# EAGLE design MirrorsDualAttenuverter (EAGLE 9.6.2)
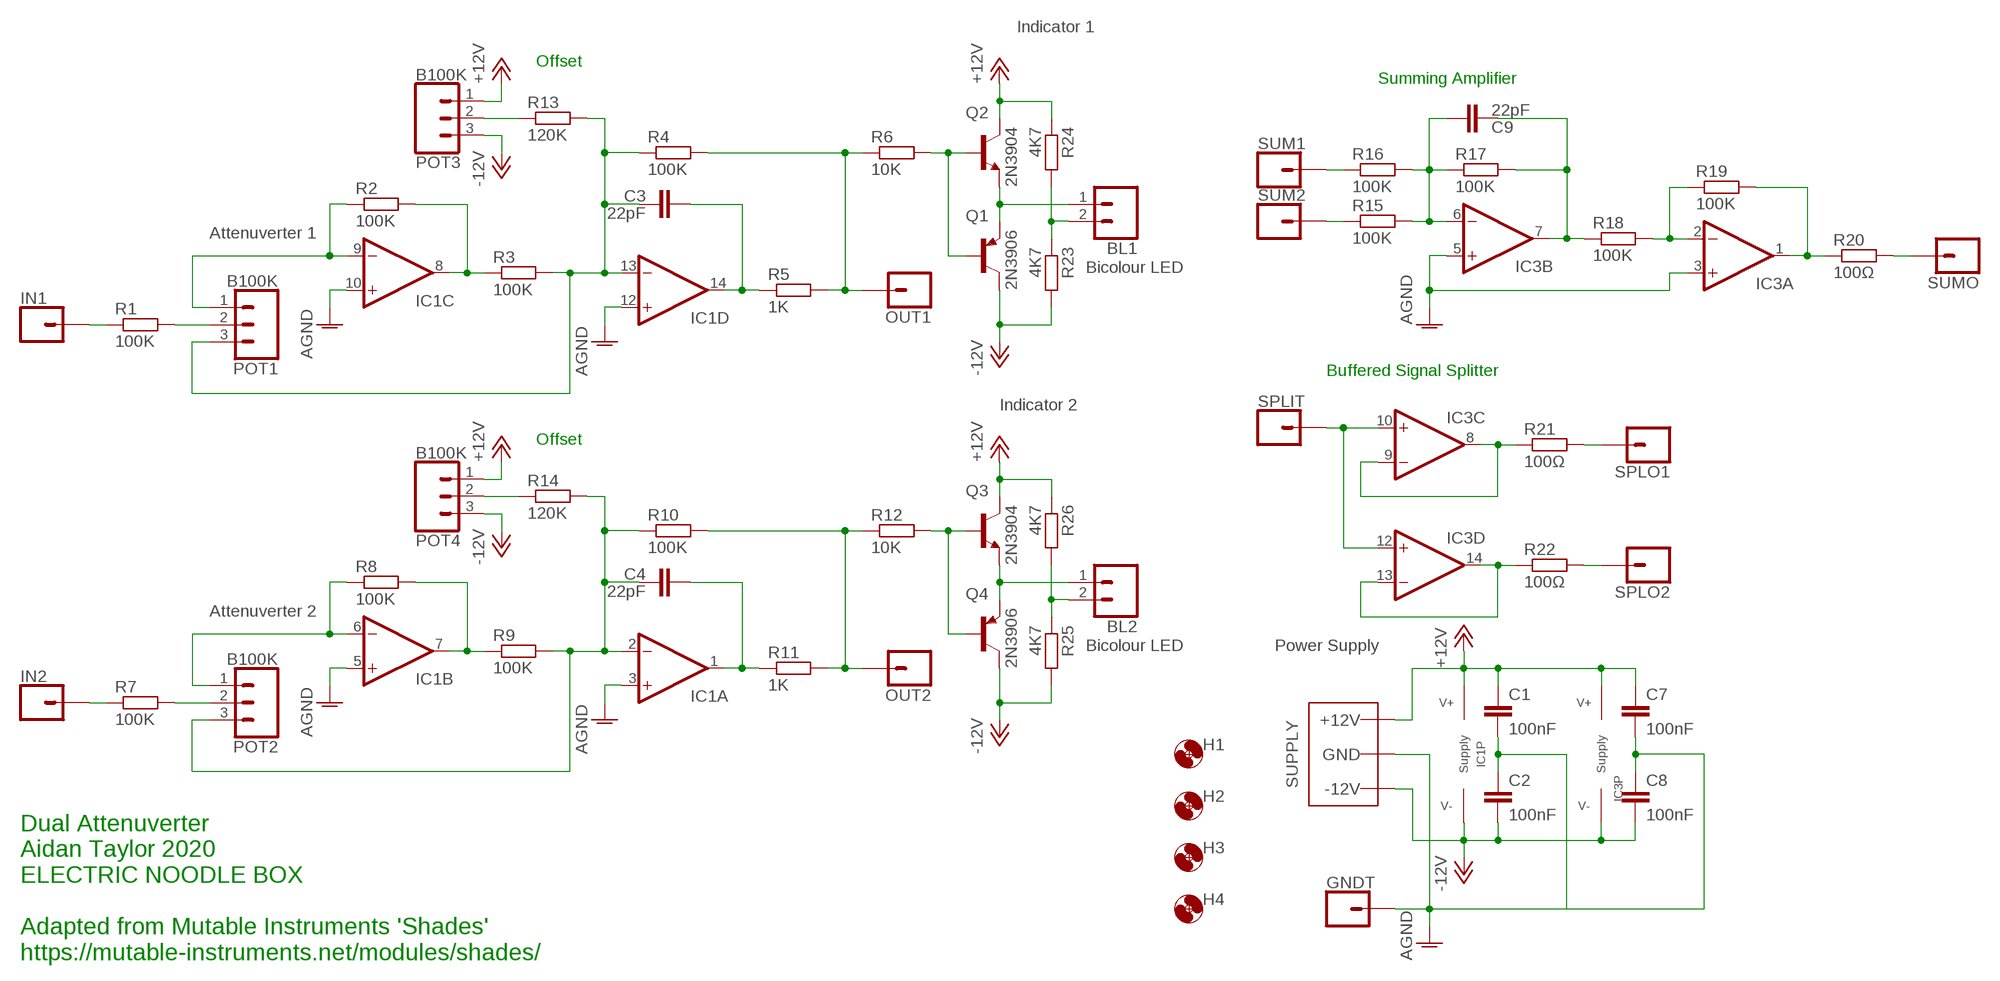
[diagram p0: schematic, sheet 1]

## Parts
BL1  2XWIREPAD  [1X02]
BL2  2XWIREPAD  [1X02]
C1  100nF  C-EU050-025X075  [C050-025X075]
C2  100nF  C-EU050-025X075  [C050-025X075]
C3  22pF  C-EU050-025X075  [C050-025X075]
C4  22pF  C-EU050-025X075  [C050-025X075]
C7  100nF  C-EU050-025X075  [C050-025X075]
C8  100nF  C-EU050-025X075  [C050-025X075]
C9  22pF  C-EU050-025X075  [C050-025X075]
GNDT  1XWIREPAD  [1X01]
H1  MOUNT-HOLE3.2  [3,2]
H2  MOUNT-HOLE3.2  [3,2]
H3  MOUNT-HOLE3.2  [3,2]
H4  MOUNT-HOLE3.2  [3,2]
IC1  TL0X4DIL  [DIL14]
IC3  TL0X4DIL  [DIL14]
IN1  1XWIREPAD  [1X01]
IN2  1XWIREPAD  [1X01]
OUT1  1XWIREPAD  [1X01]
OUT2  1XWIREPAD  [1X01]
POT1  B100K  3XWIREPAD  [1X03]
POT2  B100K  3XWIREPAD  [1X03]
POT3  B100K  3XWIREPAD  [1X03]
POT4  B100K  3XWIREPAD  [1X03]
Q1  2N3906  [TO92]
Q2  2N3904  [TO92]
Q3  2N3904  [TO92]
Q4  2N3906  [TO92]
R1  100K  R-EU_0207/10  [0207/10]
R2  100K  R-EU_0207/10  [0207/10]
R3  100K  R-EU_0207/10  [0207/10]
R4  100K  R-EU_0207/10  [0207/10]
R5  1K  R-EU_0207/10  [0207/10]
R6  10K  R-EU_0207/10  [0207/10]
R7  100K  R-EU_0207/10  [0207/10]
R8  100K  R-EU_0207/10  [0207/10]
R9  100K  R-EU_0207/10  [0207/10]
R10  100K  R-EU_0207/10  [0207/10]
R11  1K  R-EU_0207/10  [0207/10]
R12  10K  R-EU_0207/10  [0207/10]
R13  120K  R-EU_0207/10  [0207/10]
R14  120K  R-EU_0207/10  [0207/10]
R15  100K  R-EU_0207/10  [0207/10]
R16  100K  R-EU_0207/10  [0207/10]
R17  100K  R-EU_0207/10  [0207/10]
R18  100K  R-EU_0207/10  [0207/10]
R19  100K  R-EU_0207/10  [0207/10]
R20  100Ω  R-EU_0207/10  [0207/10]
R21  100Ω  R-EU_0207/10  [0207/10]
R22  100Ω  R-EU_0207/10  [0207/10]
R23  4K7  R-EU_0207/10  [0207/10]
R24  4K7  R-EU_0207/10  [0207/10]
R25  4K7  R-EU_0207/10  [0207/10]
R26  4K7  R-EU_0207/10  [0207/10]
SPLIT  1XWIREPAD  [1X01]
SPLO1  1XWIREPAD  [1X01]
SPLO2  1XWIREPAD  [1X01]
SUM1  1XWIREPAD  [1X01]
SUM2  1XWIREPAD  [1X01]
SUMO  1XWIREPAD  [1X01]
WP1  COMBO_SUPPLY_HEADER  [COMBINED_POWER]

## Nets
+12V: C1.1 C7.1 IC1.4(P:V+) IC3.4(P:V+) POT3.1 POT4.1 Q2.1(C) Q3.1(C) R24.1 R26.1 WP1.V+1(V++) WP1.V+2(V++) WP1.V+3(V++)
-12V: C2.2 C8.2 IC1.11(P:V-) IC3.11(P:V-) POT3.3 POT4.3 Q1.1(C) Q4.1(C) R23.2 R25.2 WP1.V-1(V--) WP1.V-2(V--) WP1.V-3(V--)
AGND: C1.2 C2.1 C7.2 C8.1 GNDT.1 IC1.3(A:+IN) IC1.5(B:+IN) IC1.10(C:+IN) IC1.12(D:+IN) IC3.3(A:+IN) IC3.5(B:+IN) WP1.GND1(AGND) WP1.GND2(AGND) WP1.GND3(AGND) WP1.GND4(AGND) WP1.GND5(AGND) WP1.GND6(AGND) WP1.GND7(AGND) WP1.GND8(AGND)
N$1: POT1.2 R1.2
N$2: IC1.9(C:-IN) POT1.1 R2.1
N$3: POT2.2 R7.2
N$4: IC1.8(C:OUT) R2.2 R3.1
N$5: C3.1 IC1.13(D:-IN) POT1.3 R3.2 R4.1 R13.2
N$6: OUT1.1 R4.2 R5.2 R6.1
N$7: C3.2 IC1.14(D:OUT) R5.1
N$8: Q1.2(B) Q2.2(B) R6.2
N$9: IN1.1 R1.1
N$10: IC3.2(A:-IN) R18.2 R19.1
N$11: IC1.6(B:-IN) POT2.1 R8.1
N$12: IC1.7(B:OUT) R8.2 R9.1
N$13: C4.1 IC1.2(A:-IN) POT2.3 R9.2 R10.1 R14.2
N$14: OUT2.1 R10.2 R11.2 R12.1
N$15: C4.2 IC1.1(A:OUT) R11.1
N$16: IN2.1 R7.1
N$17: Q3.2(B) Q4.2(B) R12.2
N$18: BL2.1 Q3.3(E) Q4.3(E)
N$19: BL1.1 Q1.3(E) Q2.3(E)
N$20: POT3.2 R13.1
N$21: C9.2 IC3.6(B:-IN) R15.2 R16.2 R17.1
N$22: POT4.2 R14.1
N$23: C9.1 IC3.7(B:OUT) R17.2 R18.1
N$24: IC3.1(A:OUT) R19.2 R20.1
N$25: R20.2 SUMO.1
N$26: R16.1 SUM1.1
N$27: R15.1 SUM2.1
N$28: IC3.8(C:OUT) IC3.9(C:-IN) R21.1
N$29: IC3.13(D:-IN) IC3.14(D:OUT) R22.1
N$30: IC3.10(C:+IN) IC3.12(D:+IN) SPLIT.1
N$31: R21.2 SPLO1.1
N$32: R22.2 SPLO2.1
N$33: BL1.2 R23.1 R24.2
N$34: BL2.2 R25.1 R26.2

## Notes on the sheet
- Indicator 1
- Offset
- Summing Amplifier
- Attenuverter 1
- Bicolour LED
- Buffered Signal Splitter
- Indicator 2
- Offset
- Attenuverter 2
- Bicolour LED | Power Supply
- Dual Attenuverter
  Aidan Taylor 2020
  ELECTRIC NOODLE BOX
  
  Adapted from Mutable Instruments 'Shades'
  https://mutable-instruments.net/modules/shades/

## Library data of the parts
BL1 BL2 = ElectricNoodleBox:2XWIREPAD
C1-C4 C7-C9 = rcl:C-EU: CAPACITOR, European symbol; SPICEPREFIX: C
GNDT IN1 IN2 OUT1 OUT2 SPLIT SPLO1 SPLO2 SUM1 SUM2 SUMO = ElectricNoodleBox:1XWIREPAD
H1-H4 = holes:MOUNT-HOLE: MOUNTING HOLE with drill center marker
IC1 IC3 = ElectricNoodleBox:TL0X4
POT1-POT4 = ElectricNoodleBox:3XWIREPAD
Q1 Q4 = transistor-pnp:2N3906: PNP Transistor
Q2 Q3 = transistor:2N3904: NPN TRANSISTOR
R1-R26 = rcl:R-EU_: RESISTOR, European symbol; SPICEPREFIX: R
WP1 = ElectricNoodleBox:COMBO_SUPPLY_HEADER

## Board
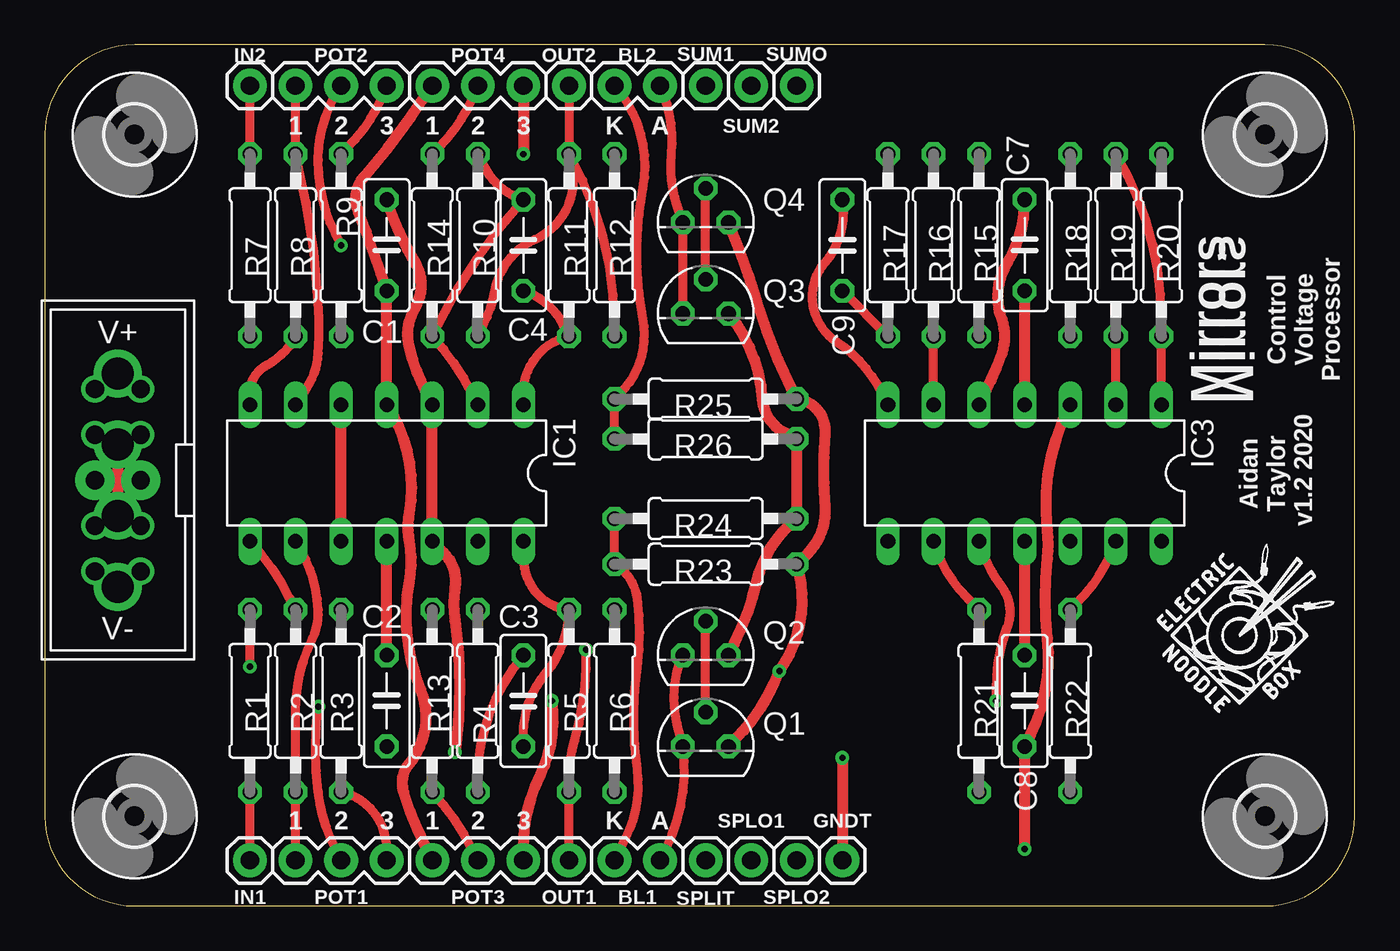
[diagram p1: board, top side]
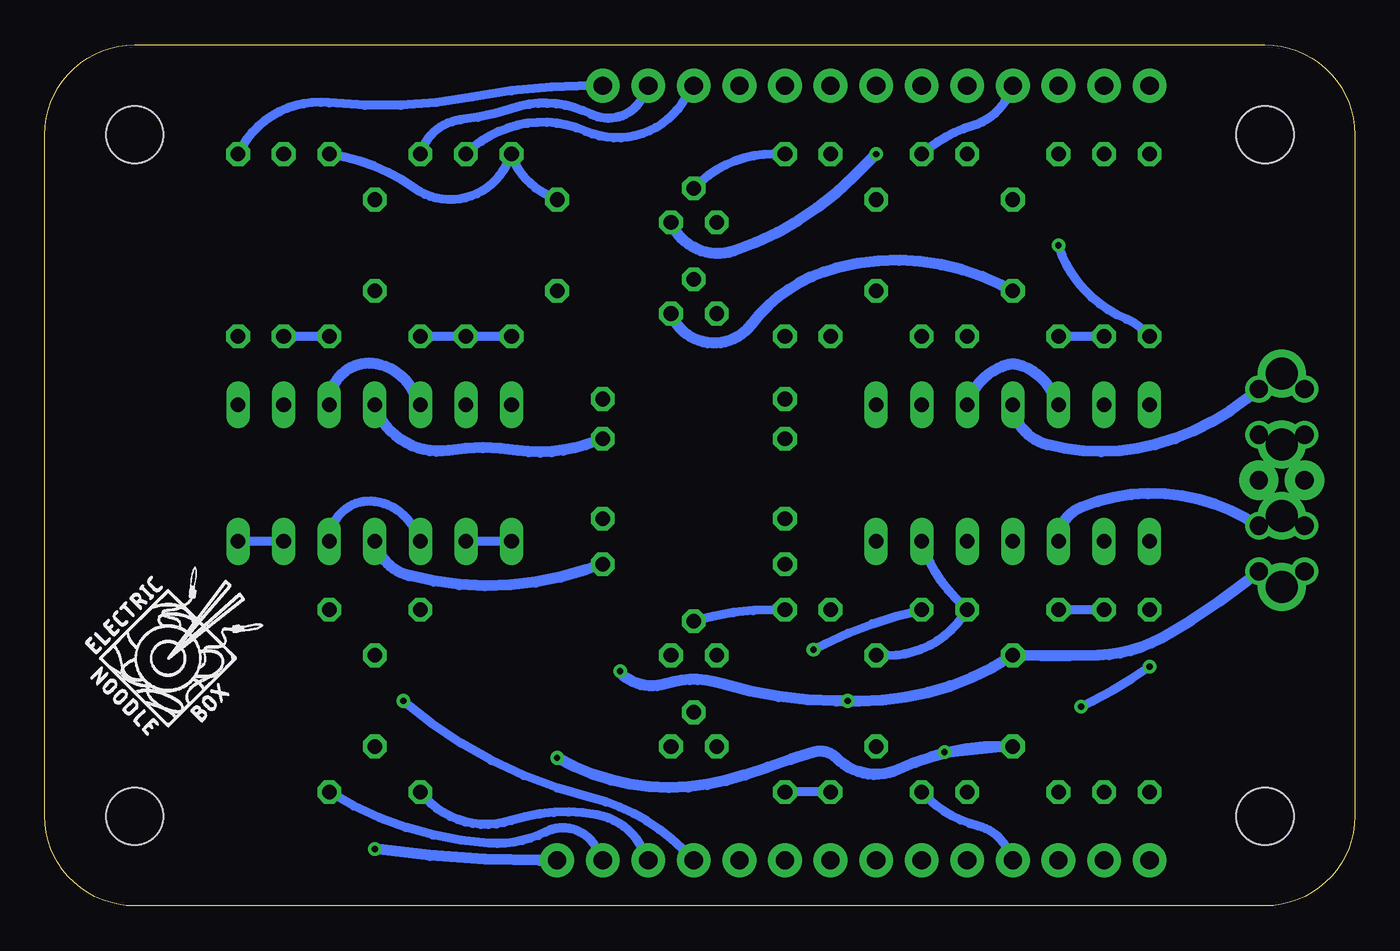
[diagram p2: board, bottom side, seen from below]

Size 73 x 48 mm. Coordinates in mm from the lower left corner, seen from the top.
Outline: 0,43 0,5 arc90 5,0 68,0 arc90 73,5 73,43 arc90 68,48 5,48 arc90 0,43
Copper layers (1*16): Top 0.035mm / dielectric 1.5mm / Bottom 0.035mm
Design rules "default": minimum track width 6mil, minimum drill 0.35mm, track to track 6mil, track to pad 6mil, pad to pad 6mil, via to via 6mil, smd to smd 6mil, copper to edge 40mil, drill to drill 6mil, minimum pad ring 10mil, minimum via ring 8mil, stop-mask expansion 4mil, vias tented up to drill 0mil, thermal gap 10mil

### Footprints (pad centres in the part's own frame; a part is rotated, then mirrored left to right if it is on the bottom)
1X02 = drill 1.016 pad 1.88: 1 0,0; 2 2.54,0
C050-025X075 = drill 0.813 octagon: 1 -2.54,0; 2 2.54,0
1X01 = drill 1.016 pad 1.88: 1 0,0
3,2 = hole 3.2: 0,0
DIL14 = drill 0.813 long: 1 -7.62,-3.81; 2 -5.08,-3.81; 3 -2.54,-3.81; 4 0,-3.81; 5 2.54,-3.81; 6 5.08,-3.81; 7 7.62,-3.81; 8 7.62,3.81; 9 5.08,3.81; 10 2.54,3.81; 11 0,3.81; 12 -2.54,3.81; 13 -5.08,3.81; 14 -7.62,3.81
1X03 = drill 1.016 pad 1.88: 1 0,0; 2 2.54,0; 3 5.08,0
TO92 = drill 0.813 octagon: 1 1.27,0; 2 0,1.905; 3 -1.27,0
0207/10 = drill 0.813 octagon: 1 -5.08,0; 2 5.08,0
COMBINED_POWER = drill 1.78: GND1 -1.98,0; GND2 1.98,0; V+1 -5.94,0; V-1 5.94,0 | drill 1.016: GND3 -2.54,1.27; GND5 2.54,1.27; GND6 -2.54,-1.27; GND8 2.54,-1.27; V+2 -5.08,1.27; V+3 -5.08,-1.27; V-2 5.08,1.27; V-3 5.08,-1.27 | drill 1.016 pad 2.184: GND4 0,1.27; GND7 0,-1.27

### Placement (x,y rotation side)
BL1  34.29,2.54 180 top
BL2  34.29,45.72 180 top
C1  19.05,36.83 90 top
C2  19.05,11.43 90 top
C3  26.67,11.43 270 top
C4  26.67,36.83 270 top
C7  54.61,36.83 90 top
C8  54.61,11.43 90 top
C9  44.45,36.83 270 top
GNDT  44.45,2.54 0 top
H1  68,5 0 top
H2  68,43 0 top
H3  5,43 0 top
H4  5,5 0 top
IC1  19.05,24.13 180 top
IC3  54.61,24.13 180 top
IN1  11.43,2.54 90 top
IN2  11.43,45.72 270 top
OUT1  29.21,2.54 90 top
OUT2  29.21,45.72 270 top
POT1  13.97,2.54 0 top
POT2  13.97,45.72 0 top
POT3  21.59,2.54 0 top
POT4  21.59,45.72 0 top
Q1  36.83,8.89 0 top
Q2  36.83,13.97 0 top
Q3  36.83,33.02 0 top
Q4  36.83,38.1 0 top
R1  11.43,11.43 90 top
R2  13.97,11.43 90 top
R3  16.51,11.43 270 top
R4  24.13,11.43 90 top
R5  29.21,11.43 270 top
R6  31.75,11.43 90 top
R7  11.43,36.83 270 top
R8  13.97,36.83 270 top
R9  16.51,36.83 90 top
R10  24.13,36.83 270 top
R11  29.21,36.83 90 top
R12  31.75,36.83 90 top
R13  21.59,11.43 90 top
R14  21.59,36.83 270 top
R15  52.07,36.83 270 top
R16  49.53,36.83 270 top
R17  46.99,36.83 90 top
R18  57.15,36.83 270 top
R19  59.69,36.83 90 top
R20  62.23,36.83 90 top
R21  52.07,11.43 270 top
R22  57.15,11.43 270 top
R23  36.83,19.05 0 top
R24  36.83,21.59 180 top
R25  36.83,28.26 0 top
R26  36.83,26.04 180 top
SPLIT  36.83,2.54 0 top
SPLO1  39.37,2.54 0 top
SPLO2  41.91,2.54 0 top
SUM1  36.83,45.72 0 top
SUM2  39.37,45.72 0 top
SUMO  41.91,45.72 0 top
U$1  [LOGO10X10]  61.91,10.48 0 top
U$2  [LOGO10X10]  70.8,9.21 0 bottom
WP1  4.07,23.73 270 top

### Tracks (layer width: path | path; a pad name or v marks a point on that pad's centre or on a via)
+12V
  Top 0.61: POT3.1 21.27,3.17 arc-10 20,6.35 arc-57 20.32,7.94 arc62 20.95,12.06 arc-32 20.32,18.1 arc20 20.32,20.32 arc-20 20.32,21.91 arc44 IC1.4 C1.1 18.73,35.24 arc3 17.46,38.73 arc-62 17.78,40.64 arc7 POT4.1 | Q2.1 38.42,14.61 arc13 39.69,18.1 arc-38 R24.1 R26.1 41.27,26.35 arc-59 40.01,28.26 arc36 Q3.1 | IC3.4 C7.1
  Bottom 0.61: R26.1 42.86,25.72 arc27 46.67,25.4 arc-18 50.48,25.4 arc81 IC3.4 | WP1.V+3 WP1.V+1 WP1.V+2 6.03,28.26 arc24 11.11,25.72 arc29 17.14,25.72 arc69 IC1.4 | C1.1 19.68,34.61 arc-41 28.89,35.56 arc-38 33.66,32.38 arc122 Q3.1
-12V  (via drill 0.35)
  Top 0.61: POT3.3 26.67,3.17 arc-26 27.62,7.3 arc34 v28.26,11.43 | C2.2 IC1.11 | C8.2 IC3.11 | Q4.1 arc-5 39.69,33.66 arc10 41.59,28.89 R25.2 arc-87 43.5,26.35 arc8 43.5,22.23 arc-49 42.55,19.68 R23.2 arc-49 41.27,13.65 v40.94,13.09 arc-24 38.42,9.21 Q1.1 | POT4.3 v26.67,41.91
  Bottom 0.61: v40.94,13.09 arc-118 40.96,13.02 arc-62 38.42,12.38 arc34 35.24,12.38 arc-17 28.89,11.43 v28.26,11.43 27.62,11.43 arc-33 C2.2 arc-3 14.29,13.97 arc-27 10.79,14.92 arc-9 6.03,18.1 WP1.V-2 WP1.V-1 WP1.V-3 | R23.2 42.86,18.73 arc33 52.7,18.41 arc61 IC3.11 | Q4.1 arc-86 34.61,36.51 arc-26 27.94,40.64 v26.67,41.91
AGND  (via drill 0.35)
  Top 0.61: v54.61,3.17 C8.1 54.93,9.53 arc33 55.88,14.92 arc-13 55.88,19.37 arc13 55.88,20.95 arc-34 IC3.3 | v44.45,8.26 GNDT.1 | v22.86,8.57 arc16 22.86,15.88 arc-16 22.86,17.78 arc53 22.23,19.68 IC1.12 IC1.3 21.27,28.57 arc-12 20.32,31.11 arc-45 20.64,33.34 arc62 20.64,35.88 arc-13 C1.2 | IC1.10 IC1.5 | WP1.GND2 WP1.GND8 | WP1.GND2 WP1.GND5 | WP1.GND2 WP1.GND7 WP1.GND1 | WP1.GND2 WP1.GND4 WP1.GND1 | WP1.GND1 WP1.GND3 | WP1.GND1 WP1.GND6 | WP1.GND1 WP1.GND2 | IC3.5 52.39,28.57 arc7 53.34,30.8 arc40 53.34,32.7 arc-51 53.66,35.88 arc32 C7.2
  Bottom 0.61: GNDT.1 45.4,2.54 arc8 v54.61,3.17 | C2.1 19.68,8.89 | 19.68,8.89 arc-25 25.4,7.62 arc71 28.89,8.26 arc-63 30.16,8.57 arc-2 33.97,7.3 arc49 v44.45,8.26 | v22.86,8.57 19.68,8.89 | WP1.GND5 6.03,21.59 arc-52 15.24,22.23 arc-69 IC1.10 | IC1.5 16.83,28.57 arc-47 18.73,30.16 arc-32 19.37,30.16 arc-58 IC1.3 | IC3.5 52.39,28.57 arc-47 54.29,30.16 arc-108 IC3.3
N$1  (via drill 0.35)
  Top 0.508: POT1.2 16.19,3.17 arc-20 15.24,6.35 arc-14 v15.24,11.11 | v11.43,13.34 R1.2
  Bottom 0.508: v15.24,11.11 14.61,11.43 arc-9 v11.43,13.34
N$2
  Top 0.508: POT1.1 R2.1 13.97,10.79 arc-26 14.92,14.92 arc29 15.24,16.51 arc30 IC1.9
N$3  (via drill 0.35)
  Top 0.508: v16.51,36.83 16.19,37.47 arc-27 15.24,41.59 arc-33 POT2.2
  Bottom 0.508: R7.2 11.75,32.07 arc-23 12.7,32.7 arc50 v16.51,36.83
N$4
  Top 0.508: R2.2 13.65,17.14 arc17 IC1.8
  Bottom 0.508: R2.2 R3.1
N$5
  Top 0.508: POT1.3 19.05,3.17 arc77 R3.2 | R4.1 24.13,6.99 arc-40 C3.1
  Bottom 0.508: POT1.3 19.37,3.17 arc-50 20.95,4.45 arc34 R4.1 | C3.1 26.04,13.97 arc-59 R13.2 22.23,17.14 arc28 IC1.13
N$6  (via drill 0.35)
  Top 0.508: OUT1.1 R5.2 29.21,6.99 arc-16 29.53,9.21 arc18 v30.16,14.29
  Bottom 0.508: R5.2 R6.1 | v30.16,14.29 29.53,14.61 arc14 R4.2
N$7
  Top 0.508: C3.2 26.67,9.53 arc-40 27.94,13.02 arc40 R5.1 arc-83 26.67,19.37 IC1.14
N$8
  Top 0.508: Q1.2 Q2.2
  Bottom 0.508: R6.2 32.38,16.51 arc-16 Q2.2
N$9
  Top 0.508: IN1.1 R1.1
N$10
  Top 0.508: IC3.2 R19.1
  Bottom 0.508: R18.2 R19.1
N$11
  Top 0.508: IC1.6 14.61,28.89 arc31 15.24,30.8 arc6 15.24,33.66 arc11 R8.1 POT2.1
N$12
  Top 0.508: IC1.7 11.43,28.57 arc-62 12.38,30.16 arc34 R8.2
  Bottom 0.508: R8.2 R9.1
N$13
  Top 0.508: IC1.2 23.81,28.57 arc17 R14.2 21.91,32.38 arc-15 C4.1 arc-46 24.45,41.27 R10.1 | R9.2 16.83,42.23 arc25 POT2.3
  Bottom 0.508: POT2.3 19.37,45.09 arc47 21.27,43.5 arc-26 R10.1
N$14
  Top 0.508: R12.1 31.75,32.38 arc30 R11.2 | R10.2 24.45,32.38 arc16 25.08,34.29 arc-55 27.3,37.15 arc87 R11.2 | OUT2.1 R11.2
N$15
  Top 0.508: IC1.1 26.67,28.57 arc-77 R11.1 28.89,32.38 arc46 C4.2
N$16
  Top 0.508: R7.1 IN2.1
N$17
  Top 0.508: Q3.2 Q4.2
  Bottom 0.508: R12.2 32.38,41.91 arc-46 Q4.2
N$18
  Top 0.508: Q3.3 Q4.3 35.24,39.05 arc-24 34.92,41.91 arc30 BL2.1
N$19
  Top 0.508: BL1.1 34.61,3.17 arc34 Q1.3 35.24,10.16 arc-38 Q2.3
N$20
  Top 0.508: POT3.2 23.81,3.17 arc17 R13.1
N$21
  Top 0.508: R17.1 C9.2 | IC3.6 R16.2
  Bottom 0.508: R17.1 R16.2 R15.2
N$22
  Top 0.508: R14.1 21.91,42.23 arc25 POT4.2
N$23
  Top 0.508: IC3.7 46.67,28.57 arc30 44.13,31.43 arc-97 43.5,35.88 arc50 C9.1
  Bottom 0.508: C9.1 45.09,39.69 arc46 R17.2 47.31,41.27 arc99 52.39,40.01 arc-27 R18.1
N$24
  Top 0.508: IC3.1 R20.1 62.23,32.7 arc31 R19.2
N$25
  Bottom 0.508: SUMO.1 42.55,45.72 arc-11 49.21,45.09 arc17 57.15,44.77 arc-71 R20.2
N$26
  Bottom 0.508: SUM1.1 37.47,44.77 arc80 42.86,43.18 arc-69 R16.1
N$27
  Bottom 0.508: SUM2.1 39.69,45.09 arc90 42.55,44.13 arc-45 46.99,44.45 arc12 49.85,43.81 arc-68 R15.1
N$28
  Top 0.508: R21.1 51.44,17.14 arc-28 IC3.9
  Bottom 0.508: IC3.8 IC3.9
N$29
  Top 0.508: R22.1 57.47,16.83 arc25 IC3.13
  Bottom 0.508: IC3.13 IC3.14
N$30  (via drill 0.35)
  Top 0.508: v53.02,11.43 53.02,12.06 arc-21 53.66,15.56 arc57 53.34,17.78 arc-21 IC3.10
  Bottom 0.508: SPLIT.1 37.47,3.17 arc-31 42.55,6.03 arc27 v53.02,11.43 | IC3.10 52.39,20.95 arc-56 54.61,22.54 arc-98 IC3.12
N$31
  Bottom 0.508: SPLO1.1 39.69,3.17 arc-53 42.23,5.08 arc-28 46.99,4.76 arc71 R21.2
N$32
  Bottom 0.508: SPLO2.1 42.23,3.17 arc-90 45.09,4.13 arc31 48.26,3.49 arc28 R22.2
N$33
  Top 0.508: BL1.2 32.38,3.81 arc34 33.02,7.62 arc-15 33.02,13.34 arc15 33.02,17.14 arc52 R23.1 R24.2
N$34
  Top 0.508: R26.2 R25.1 32.07,28.57 arc56 33.34,32.7 arc-22 33.34,40.01 arc53 BL2.2

### Text on the board
tPlace: 1 | 2 | 3 | 1 | 2 | 3 | K | A | Mirrors | Mirrors | Control / Voltage / Processor | Aidan / Taylor / v1.2 2020 | 1 | 2 | 3 | 1 | 2 | 3 | K | A